# Altium schematic sheet 5_p4_metal_detect.schdoc
size 307 x 218 mm; Symbol: Sheet-Symbol_A4; Device: Sheet-Symbol_A4; @Project Name: ai_camera; @Page Count: 5; @Update Date: 2026-03-13; @Create Date: 2026-03-13; @Schematic Name: Schematic1; @Page No: 5; @Page Name: p4_metal_detect; @Board Name: Board1; Company: 嘉立创EDA; Version: V1.0; Page Size: A4; Convert to PCB: yes; Add into BOM: yes; Title Block Position: 3; Width: 1170; Height: 825; Region Start: 1; X Region Count: 6; Y Region Count: 4; Blade Width: 10; @Create Time: 03:40:31; @Update Time: 14:53:56
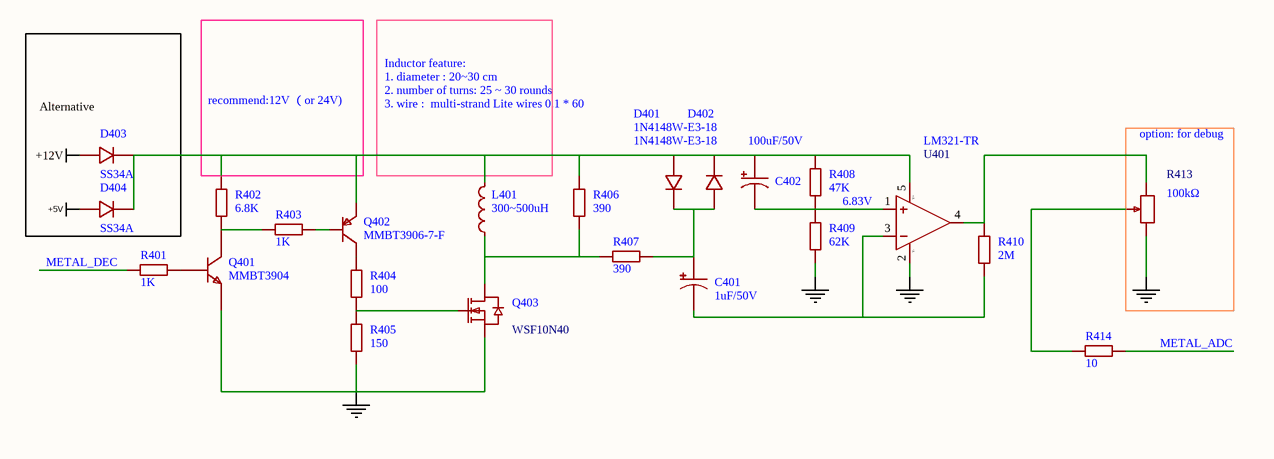
[diagram p0: 5_p4_metal_detect.schdoc]

## Parts
C401  1uF/50V  [CAP-SMD_BD5.0-L5.3-W5.3-RD]
C402  100uF/50V  [CAP-SMD_BD5.0-L5.3-W5.3-RD]
D401  1N4148W-E3-18  [SOD-123_L2.7-W1.6-LS3.7-FD]
D402  1N4148W-E3-18  [SOD-123_L2.7-W1.6-LS3.7-FD]
D403  SS34A  [SMA_L4.3-W2.6-LS5.2-RD]
D404  SS34A  [SMA_L4.3-W2.6-LS5.2-RD]
L401  300~500uH  [CONN-TH_2P-P3.81_KF2EDGV-3.81-2P]
Q401  MMBT3904  [SOT-23-3_L2.9-W1.3-P1.90-LS2.4-BR]
Q402  MMBT3906-7-F  [SOT-23-3_L2.9-W1.6-P1.90-LS2.8-BR]
Q403  (no value)  [TO-252-2_L6.6-W6.1-P4.57-LS9.9-BR-CW]
R401  1K  [R0603]
R402  6.8K  [R0603]
R403  1K  [R0603]
R404  100  [R0603]
R405  150  [R0603]
R406  390  [R0603]
R407  390  [R0603]
R408  47K  [R0603]
R409  62K  [R0603]
R410  2M  [R0603]
R413  100kΩ  [RES-ADJ-TH_3296W]
R414  10  [R0603]
U401  LM321-TR  [SOT-23-5_L3.0-W1.7-P0.95-LS2.8-BR]

## Blocks framed on the sheet
Alternative: D403 D404
option: for debug: R413

## Nets
+5V: D404.2(A)
+12V: D403.2(A)
GND: Q401.2(E) Q403.3(S) R405.1 R409.2 R413.3 U401.2(V-)
METAL_ADC: R414.2
METAL_DEC: R401.1
NetC401_1: C401.1 D401.2(K) D402.1(A) R407.1
NetC401_2: C401.2 R410.2 U401.3(-IN)
NetC402_1: C402.1 D401.1(A) D402.2(K) D403.1(C) D404.1(C) L401.2 Q402.2(E) R402.2 R406.2 R408.1 U401.5(V+)
NetC402_2: C402.2 R408.2 R409.1 U401.1(+IN)
NetL401_1: L401.1 Q403.2(D) R406.1 R407.2
NetQ401_1: Q401.1(B) R401.2
NetQ401_3: Q401.3(C) R402.1 R403.1
NetQ402_1: Q402.1(B) R403.2
NetQ402_3: Q402.3(C) R404.2
NetQ403_1: Q403.1(G) R404.1 R405.2
NetR410_1: R410.1 R413.1 U401.4(OUT)
NetR413_2: R413.2 R414.1

## Notes on the sheet
- (near L401) Inductor feature:
  1. diameter : 20~30 cm
  2. number of turns: 25 ~ 30 rounds
  3. wire :  multi-strand Lite wires 0.1 * 60
- recommend:12V （or 24V)
- 6.83V
- 1
- 2
- 3
- 4
- 5
- 6
- A
- B
- C
- 原理图
- Schematic1
- 创建日期
- 更新日期
- 2026-03-13
- 绘制
- 板子
- Board1
- 图页
- p4_metal_detect
- D
- 审阅
- 版本
- 尺寸
- ai_camera
- 页
- 共
- V1.0
- A4
- 嘉立创EDA

## Library data of the parts
C401 C402 = VE-100M1HTR-0505: Manufacturer: lelon(立隆); Symbol: VE-100M1H0505-TRO; Add into BOM: yes; Value: 10uF; Tolerance: ±20%; Rated Voltage: 50V; φD: 5mm; L: 5.3mm; Lifetime @ Temp: 2000hrs@85℃; Device: VE-100M1HTR-0505; LCSC Part Name: 10uF ±20% 50V; Supplier Part: C249452; Manufacturer Part: VE-100M1HTR-0505; Supplier Footprint: SMD,5x5.3mm; JLCPCB Part Class: Extended Part; Datasheet: https://atta.szlcsc.com/upload/public/pdf/source/20181106/C249452_C5B8ED999F8C18BC1848EF9392F5AAFB.pdf; Supplier: LCSC; Convert to PCB: yes; Ripple Current: -; Equivalent Series Resistance(ESR): -; Operating Temperature: -40℃~+85℃
D401 D402 = 1N4148W-E3-18: Manufacturer: VISHAY(威世); Add into BOM: yes; Power Dissipation: 350mW; Reverse Voltage (Vr): 100V; Average Rectified Current (Io): 150mA; Forward Voltage (Vf@If): 1.2V@100mA; Reverse Leakage Current: 100μA@100V; Reverse Recovery Time (trr): 4ns; Symbol: 1N4148W-E3-18; Device: 1N4148W-E3-18; LCSC Part Name: 100V 150mA 4ns; Supplier Part: C191428; Manufacturer Part: 1N4148W-E3-18; Supplier Footprint: SOD-123; JLCPCB Part Class: Extended Part; Datasheet: https://atta.szlcsc.com/upload/public/pdf/source/20180503/C191428_AD0ED457CC768099CBC92C1868282AFA.pdf; Supplier: LCSC; Convert to PCB: yes; Diode Configuration: -; Operating Temperature: +150℃@(Tj)
D403 D404 = SS34A_C211775: Manufacturer: YANGJIE(扬杰); Add into BOM: yes; Reverse Voltage (Vr): 40V; Average Rectified Current (Io): 3A; Forward Voltage (Vf@If): 500mV@3A; Symbol: SS34A; Device: SS34A_C211775; LCSC Part Name: 40V 3A 500mV@3A; Supplier Part: C211775; Manufacturer Part: SS34A; Supplier Footprint: SMA; JLCPCB Part Class: Extended Part; Datasheet: https://atta.szlcsc.com/upload/public/pdf/source/20190516/C211775_5CF5F6A2E43CD0CA4A389CCA8A88582C.pdf; Supplier: LCSC; Convert to PCB: yes
L401 = CKL0514-470uH/J-CCA T: Manufacturer: CENKER(岑科); Add into BOM: yes; Type: 色环电感; Value: 470uH; Tolerance: ±5%; Rated Current: 280mA; DC Resistance: 3.22Ω; Symbol: CKL0514-470UH/J-CCA T; Device: CKL0514-470uH/J-CCA T; LCSC Part Name: 470uH ±5% 280mA 3.22Ω; Supplier Part: C354673; Manufacturer Part: CKL0514-470uH/J-CCA T; Supplier Footprint: 轴向引线; JLCPCB Part Class: Extended Part; Datasheet: https://atta.szlcsc.com/upload/public/pdf/source/20190315/C354673_825EB25F3EB411343FC5F933A0BC0339.pdf; Supplier: LCSC; Convert to PCB: yes; Q @ Frequency: -; Frequency - Self Resonant: -
Q401 = MMBT3904: Manufacturer: ST(先科); Symbol: MMBT3904_C84104; Add into BOM: yes; Transistor Type: NPN; Collector-Emitter Breakdown Voltage (Vceo): 40V; Collector Current (Ic): 200mA; Power Dissipation (Pd): 350mW; Collector Cut-Off Current (Icbo): 50nA; Collector-Emitter Saturation Voltage (VCE(sat)@Ic,Ib): 300mV@50mA,5mA; DC Current Gain (hFE@Ic,Vce): 100@10mA,1V; Transition Frequency (fT): 300MHz; Device: MMBT3904; LCSC Part Name: MMBT3904; Supplier Part: C84104; Manufacturer Part: MMBT3904; Supplier Footprint: SOT-23(SOT-23-3); JLCPCB Part Class: Extended Part; Datasheet: https://atta.szlcsc.com/upload/public/pdf/source/20161024/1477288599731.pdf; Supplier: LCSC; Convert to PCB: yes; Operating Temperature: +150℃@(Tj)
Q402 = MMBT3906-7-F: Manufacturer: DIODES(美台); Add into BOM: yes; Transistor Type: PNP; Collector-Emitter Breakdown Voltage (Vceo): 40V; Collector Current (Ic): 200mA; Power Dissipation (Pd): 300mW; Collector-Emitter Saturation Voltage (VCE(sat)@Ic,Ib): 400mV@50mA,5mA; DC Current Gain (hFE@Ic,Vce): 100@10mA,1V; Transition Frequency (fT): 250MHz; Symbol: MMBT3906-7-F; Device: MMBT3906-7-F; LCSC Part Name: MMBT3906-7-F; Supplier Part: C82762; Manufacturer Part: MMBT3906-7-F; Supplier Footprint: SOT-23(SOT-23-3); JLCPCB Part Class: Extended Part; Datasheet: https://atta.szlcsc.com/upload/public/pdf/source/20171221/C82762_15138313065711195601.pdf; Supplier: LCSC; Convert to PCB: yes; Collector Cut-Off Current (Icbo): -; Operating Temperature: -55℃~+150℃@(Tj)
Q403 = WSF10N40: Add into BOM: yes; Symbol: WSF10N40; Device: WSF10N40; Convert to PCB: yes
R401-R410 R414 = Res_0603: Symbol: 电阻; Convert to PCB: yes; Value: 10K; Device: Res_0603; Add into BOM: yes; Supplier Footprint: 0603
R413 = 3296W-1-102_C330429: Manufacturer: BOCHEN(博晨); Add into BOM: yes; Temperature Coefficient: ±250ppm/℃; Tolerance: ±10%; Symbol: 3296W-1-102_C330429; Device: 3296W-1-102_C330429; LCSC Part Name: 1kΩ ±10% 200/袋; Manufacturer Part: 3296W-1-102; Supplier Footprint: 插件; JLCPCB Part Class: Extended Part; Datasheet: https://atta.szlcsc.com/upload/public/pdf/source/20181127/C330429_FEC3738CC66D226D2C83EEA9DBFCD01B.pdf; Supplier: LCSC; Convert to PCB: yes; Value: 100kΩ; Type: 可调电阻
U401 = LM321-TR_C97688: Manufacturer: 3PEAK; Add into BOM: yes; Amplifier Type: General Purpose; Number of Circuits: 1; Gain Bandwidth Product（GBP）: 1.2MHz; Slew Rate（SR）: 0.55 V/us; Supply Voltage（Single）: 3V ~ 36V, ±1.5V ~ 18V; Iq per channel (Typ): 200μA; Symbol: LM321-TR; Device: LM321-TR_C97688; LCSC Part Name: LM321-TR; Supplier Part: C97688; Manufacturer Part: LM321-TR; Supplier Footprint: SOT-23-5; JLCPCB Part Class: Extended Part; Datasheet: https://atta.szlcsc.com/upload/public/pdf/source/20170322/1490151696478.pdf; Supplier: LCSC; Convert to PCB: yes